# Altium schematic sheet SYSTEM_PMIC_RK805.SchDoc
size A3; SheetNumber: 4; SheetTotal: 21
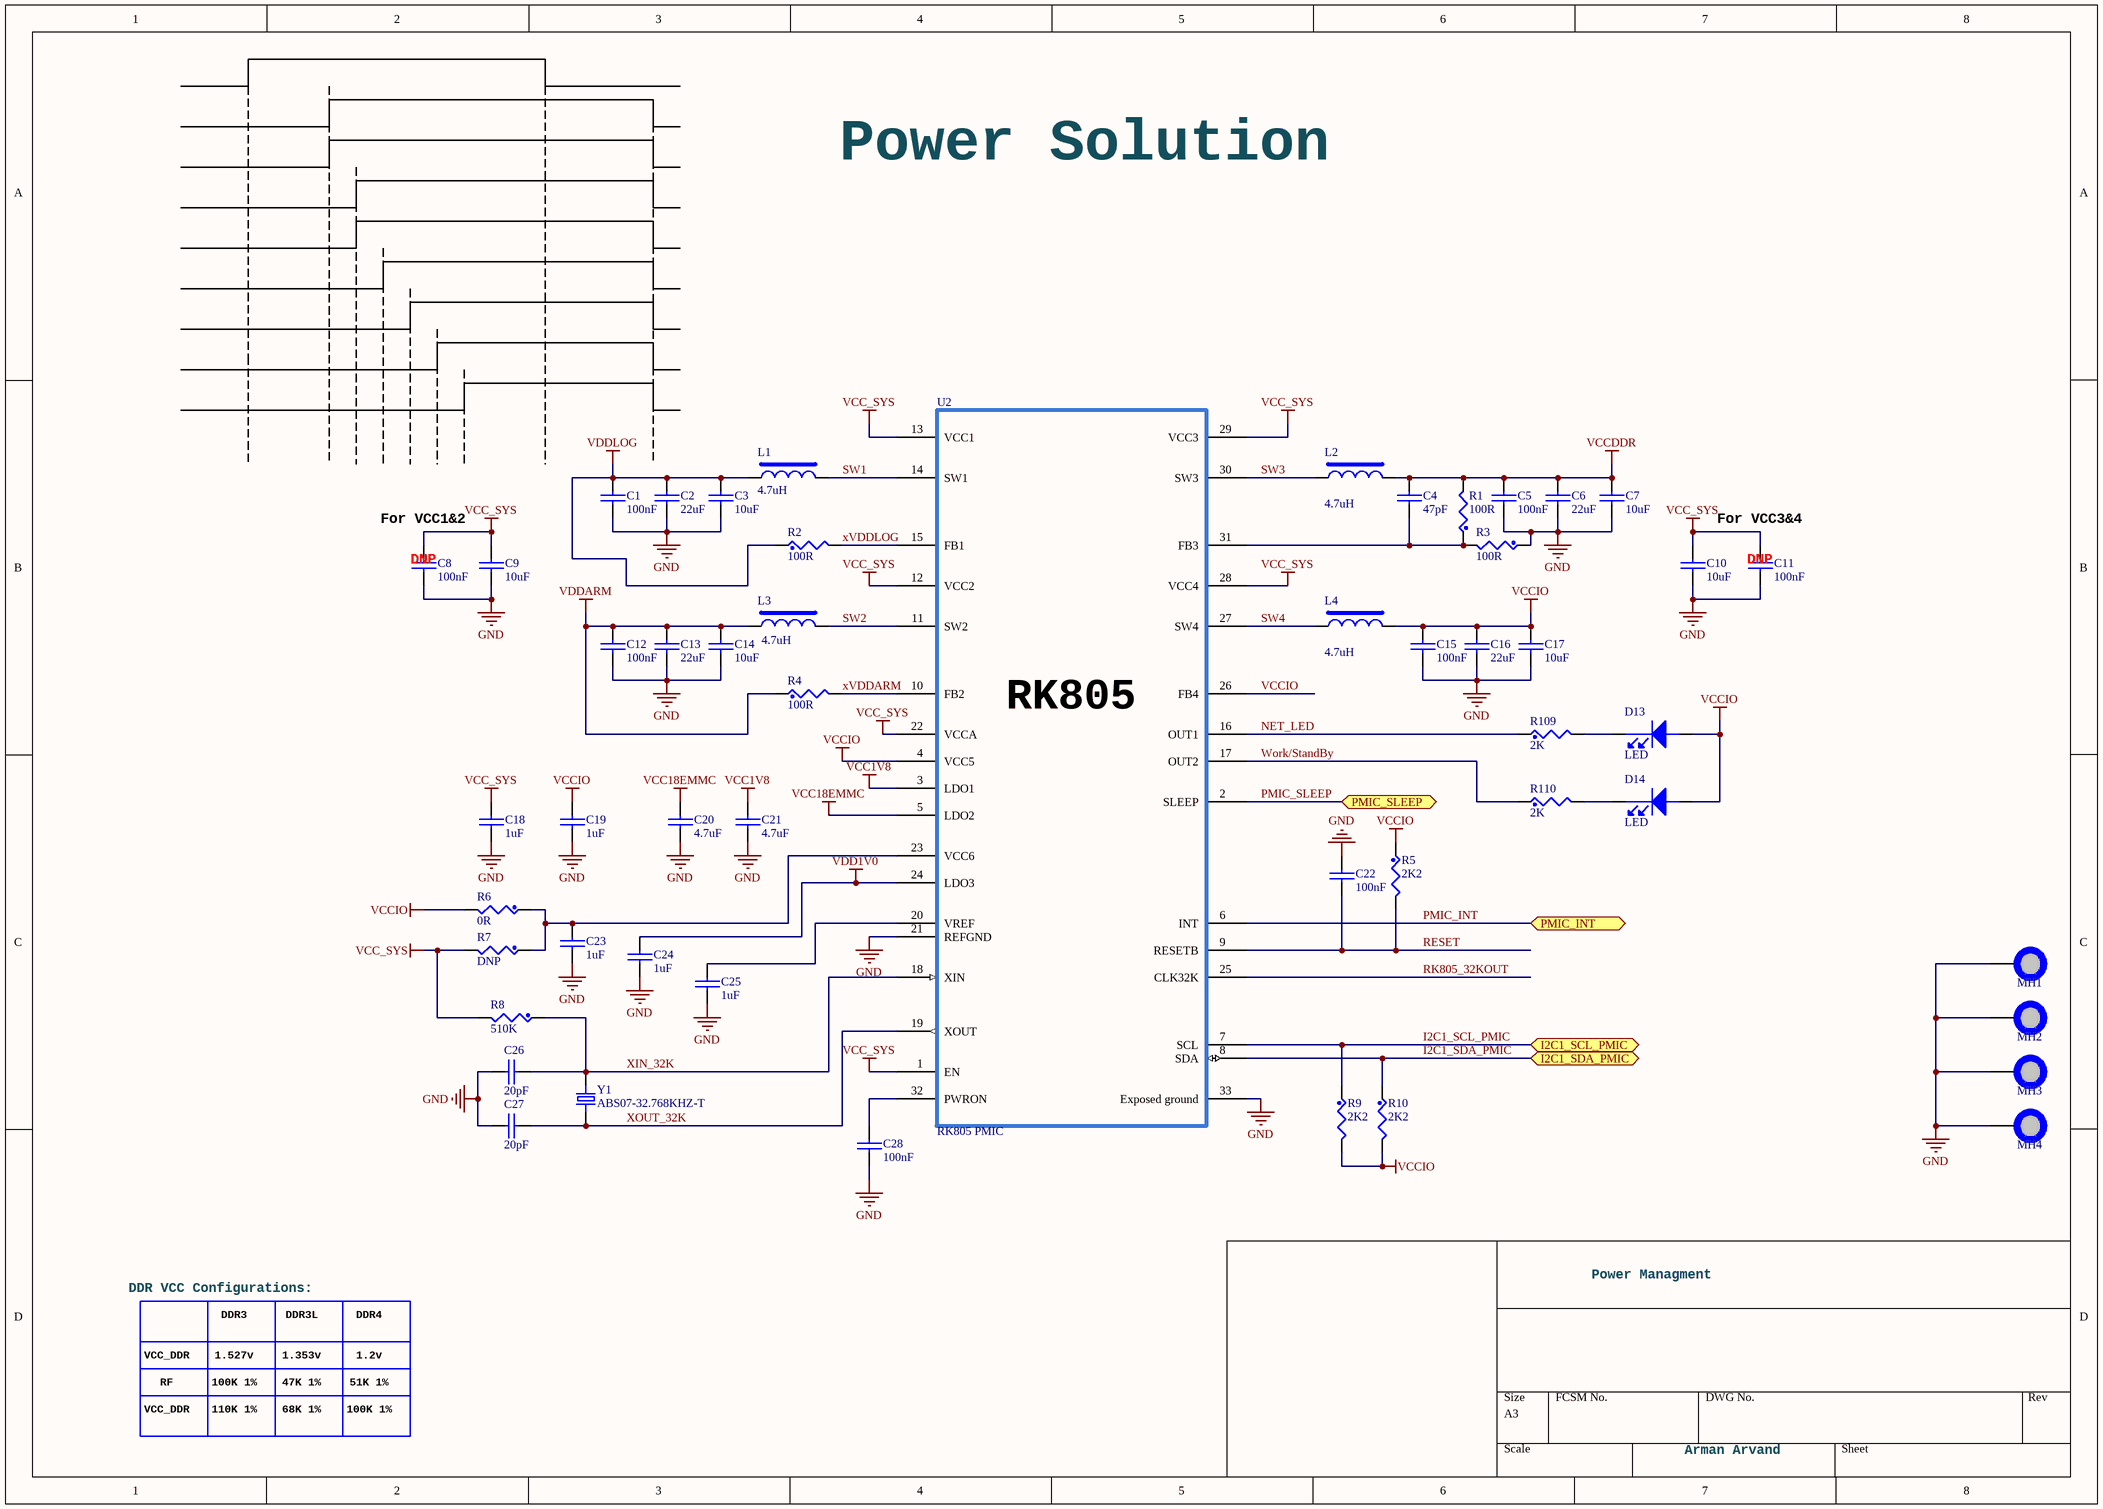
[diagram p0: SYSTEM_PMIC_RK805.SchDoc]

## Parts
C1  100nF  [0402_CC - C]
C2  22uF  [0603_CC]
C3  10uF  [0603_CC]
C4  47pF  [0402_CC - C]
C5  100nF  [0402_CC - C]
C6  22uF  [0603_CC]
C7  10uF  [0603_CC]
C8  100nF  [0402_CC - C]
C9  10uF  [0805_CC]
C10  10uF  [0805_CC]
C11  100nF  [0402_CC - C]
C12  100nF  [0402_CC - C]
C13  22uF  [0603_CC]
C14  10uF  [0603_CC]
C15  100nF  [0402_CC - C]
C16  22uF  [0603_CC]
C17  10uF  [0603_CC]
C18  1uF  [0402_CC - C]
C19  1uF  [0402_CC - C]
C20  4.7uF  [0603_CC]
C21  4.7uF  [0603_CC]
C22  100nF  [0402_CC - C]
C23  1uF  [0402_CC - C]
C24  1uF  [0402_CC - C]
C25  1uF  [0402_CC - C]
C26  20pF  [0402_CC - C]
C27  20pF  [0402_CC - C]
C28  100nF  [0402_CC - C]
D13  LED  [LED_0603]
D14  LED  [LED_0603]
L1  value 4.7uH  [INDC3020X12N]  (hidden comment: Fixed Inductors 4.7uH 20% 200mOhm 1.9A)
L2  value 4.7uH  [INDC3020X12N]  (hidden comment: Fixed Inductors 4.7uH 20% 200mOhm 1.9A)
L3  value 4.7uH  [INDC3020X12N]  (hidden comment: Fixed Inductors 4.7uH 20% 200mOhm 1.9A)
L4  value 4.7uH  [INDC3020X12N]  (hidden comment: Fixed Inductors 4.7uH 20% 200mOhm 1.9A)
MH1  MH_5MMC_2.2MMD  [MH_5MMD_2.2MMD]  (value not drawn)  (no BOM)
MH2  MH_5MMC_2.2MMD  [MH_5MMD_2.2MMD]  (value not drawn)  (no BOM)
MH3  MH_5MMC_2.2MMD  [MH_5MMD_2.2MMD]  (value not drawn)  (no BOM)
MH4  MH_5MMC_2.2MMD  [MH_5MMD_2.2MMD]  (value not drawn)  (no BOM)
R1  100R  [0402_CR]
R2  100R  [0402_CR]
R3  100R  [0402_CR]
R4  100R  [0402_CR]
R5  2K2  [0402_CR]
R6  0R  [0402_CR]
R7  DNP  [0402_CR]
R8  510K  [0402_CR]
R9  2K2  [0402_CR]
R10  2K2  [0402_CR]
R109  2K  [0402_CR]
R110  2K  [0402_CR]
U2  RK805 PMIC  [QFN40P400X400X80_HS-33N]
Y1  ABS07-32.768KHZ-T  [XTAL_ABS07-32.768KHZ-T]

## Ports
I2C1_SCL_PMIC (bidir), I2C1_SDA_PMIC (bidir), PMIC_INT (bidir), PMIC_SLEEP (bidir)

## Nets
GND: C1.2 C2.2 C3.2 C5.2 C6.2 C7.2 C8.2 C9.2 C10.2 C11.2 C12.2 C13.2 C14.2 C15.2 C16.2 C17.2 C18.2 C19.2 C20.2 C21.2 C22.2 C23.2 C24.2 C25.2 C26.1 C27.1 C28.1 MH1.1 MH2.1 MH3.1 MH4.1 R3.1 U2.21(REFGND) U2.33(Exposed_ground)
VCC1V8: C21.1 U2.3(LDO1)
VCC18EMMC: C20.1 U2.5(LDO2)
VCC_SYS: C8.1 C9.1 C10.1 C11.1 C18.1 R7.2 R8.2 U2.1(EN) U2.12(VCC2) U2.13(VCC1) U2.22(VCCA) U2.28(VCC4) U2.29(VCC3)
VCCDDR: C4.1 C5.1 C6.1 C7.1 L2.2 R1.2
VCCIO: C15.1 C16.1 C17.1 C19.1 D13.A(ANODE) D14.A(ANODE) L4.2 R5.1 R6.2 R9.2 R10.2 U2.4(VCC5) U2.26(FB4)
VDD1V0: C24.1 U2.24(LDO3)
VDDARM: C12.1 C13.1 C14.1 L3.1 R4.1
VDDLOG: C1.1 C2.1 C3.1 L1.1 R2.1
I2C1_SCL_PMIC: R9.1 U2.7(SCL) ; port I2C1_SCL_PMIC
I2C1_SDA_PMIC: R10.1 U2.8(SDA) ; port I2C1_SDA_PMIC
NET_LED: R109.1 U2.16(OUT1)
PMIC_INT: U2.6(INT) ; port PMIC_INT
PMIC_SLEEP: U2.2(SLEEP) ; port PMIC_SLEEP
RESET: C22.1 R5.2 U2.9(RESETB)
RK805_32KOUT: U2.25(CLK32K)
SW1: L1.2 U2.14(SW1)
SW2: L3.2 U2.11(SW2)
SW3: L2.1 U2.30(SW3)
SW4: L4.1 U2.27(SW4)
Work/StandBy: R110.1 U2.17(OUT2)
XIN_32K: C26.2 R8.1 U2.18(XIN) Y1.2
XOUT_32K: C27.2 U2.19(XOUT) Y1.1
xVDDARM: R4.2 U2.10(FB2)
xVDDLOG: R2.2 U2.15(FB1)
NetC4_2: C4.2 R1.1 R3.2 U2.31(FB3)
NetC23_1: C23.1 R6.1 R7.1 U2.23(VCC6)
NetC25_1: C25.1 U2.20(VREF)
NetC28_2: C28.2 U2.32(PWRON)
NetD13_C: D13.C(CATHODE) R109.2
NetD14_C: D14.C(CATHODE) R110.2

## Notes on the sheet
- Power Solution
- For VCC1&2
- For VCC3&4
- (near C8) DNP
- (near C11) DNP
- DDR VCC Configurations:
- DDR3
- DDR3L
- DDR4
- Power Managment
- VCC_DDR
- RF
- 1.527v
- 100K 1%
- 1.353v
- 47K 1%
- 1.2v
- 51K 1%
- 110K 1%
- 68K 1%
- Arman Arvand

## Library data of the parts
C1-C28 = CAP_NP: CLASS: DISCRETE
D13 D14 = LED: CLASS: IC
L1-L4 = TMS252012ALM-4R7MTAA: Fixed Inductors 4.7uH 20% 200mOhm 1.9A, From TDK, / Lis: AAR; Type: Thin Film; Maximum DC Current: 1.6 A; Maximum DC Resistance:: 200 mOhms; ComponentLink1Description: Mouser; ComponentLink1URL: https://www.mouser.com/ProductDetail/TDK/TMS252012ALM-4R7MTAA?qs=7MVldsJ5UazqXFKTXswO8w%3D%3D; Mfr_Part_No: TMS252012ALM-4R7MTAA; Mouser No: 810-TMS252012ALM4R7M; Mfr: TDK; Package/Case: 1008 (2520 metric); Length: 2.5 mm; Width: 2 mm; Case Code - in: 1008; Case Code - mm: 2520; Supplier 1: Digi-Key; Supplier 2: Digi-Key; Supplier 3: Digi-Key; Supplier 4: Mouser; Supplier Part Number 1: 445-TMS252012ALM-4R7MTAACT-ND; Supplier Part Number 2: 445-TMS252012ALM-4R7MTAADKR-ND; Supplier Part Number 3: 445-TMS252012ALM-4R7MTAATR-ND; Supplier Part Number 4: 810-TMS252012ALM4R7M
MH1-MH4 = MH_5MMC_2.2MMD: Mounting Hole 5mm Diameter, 2.2mm Drill
R1-R10 R109 R110 = RES: CLASS: DISCRETE
U2 = RK805: RK805 PMIC, AAR
Y1 = ABS07-32.768KHZ-T: 32.768kHz Â±20ppm Crystal 12.5pF 70 kOhms 2-SMD, No Lead; Mfr: Abracon LLC; Mfr_Part_No: ABS07-32.768KHZ-4-T; Price: None; Value: *; Package: SMD-2 Abracon; Availability: Unavailable; Mouser No: 815-ABS07-32.7K-4-T